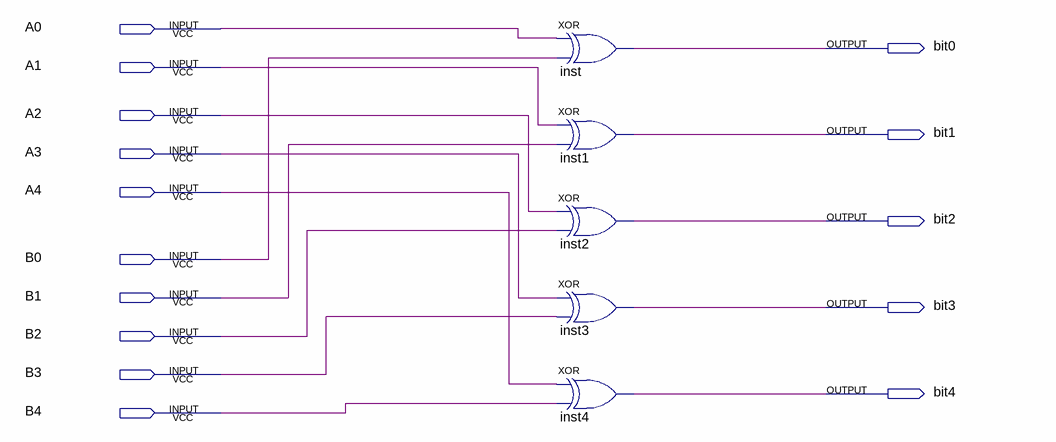
[diagram p0: schematic sheet]
// Quartus schematic bloco_AxorB.bdf as structural Verilog: 5 symbols, 15 pins
module bloco_AxorB (
  input  A0,
  input  A1,
  input  A2,
  input  A3,
  input  A4,
  input  B0,
  input  B1,
  input  B2,
  input  B3,
  input  B4,
  output bit0,
  output bit1,
  output bit2,
  output bit3,
  output bit4
);

  xor inst (bit0, A0, B0);
  xor inst1 (bit1, A1, B1);
  xor inst2 (bit2, A2, B2);
  xor inst3 (bit3, A3, B3);
  xor inst4 (bit4, A4, B4);
endmodule
